# Altium schematic sheet SHEET3.SCHDOC
size A1
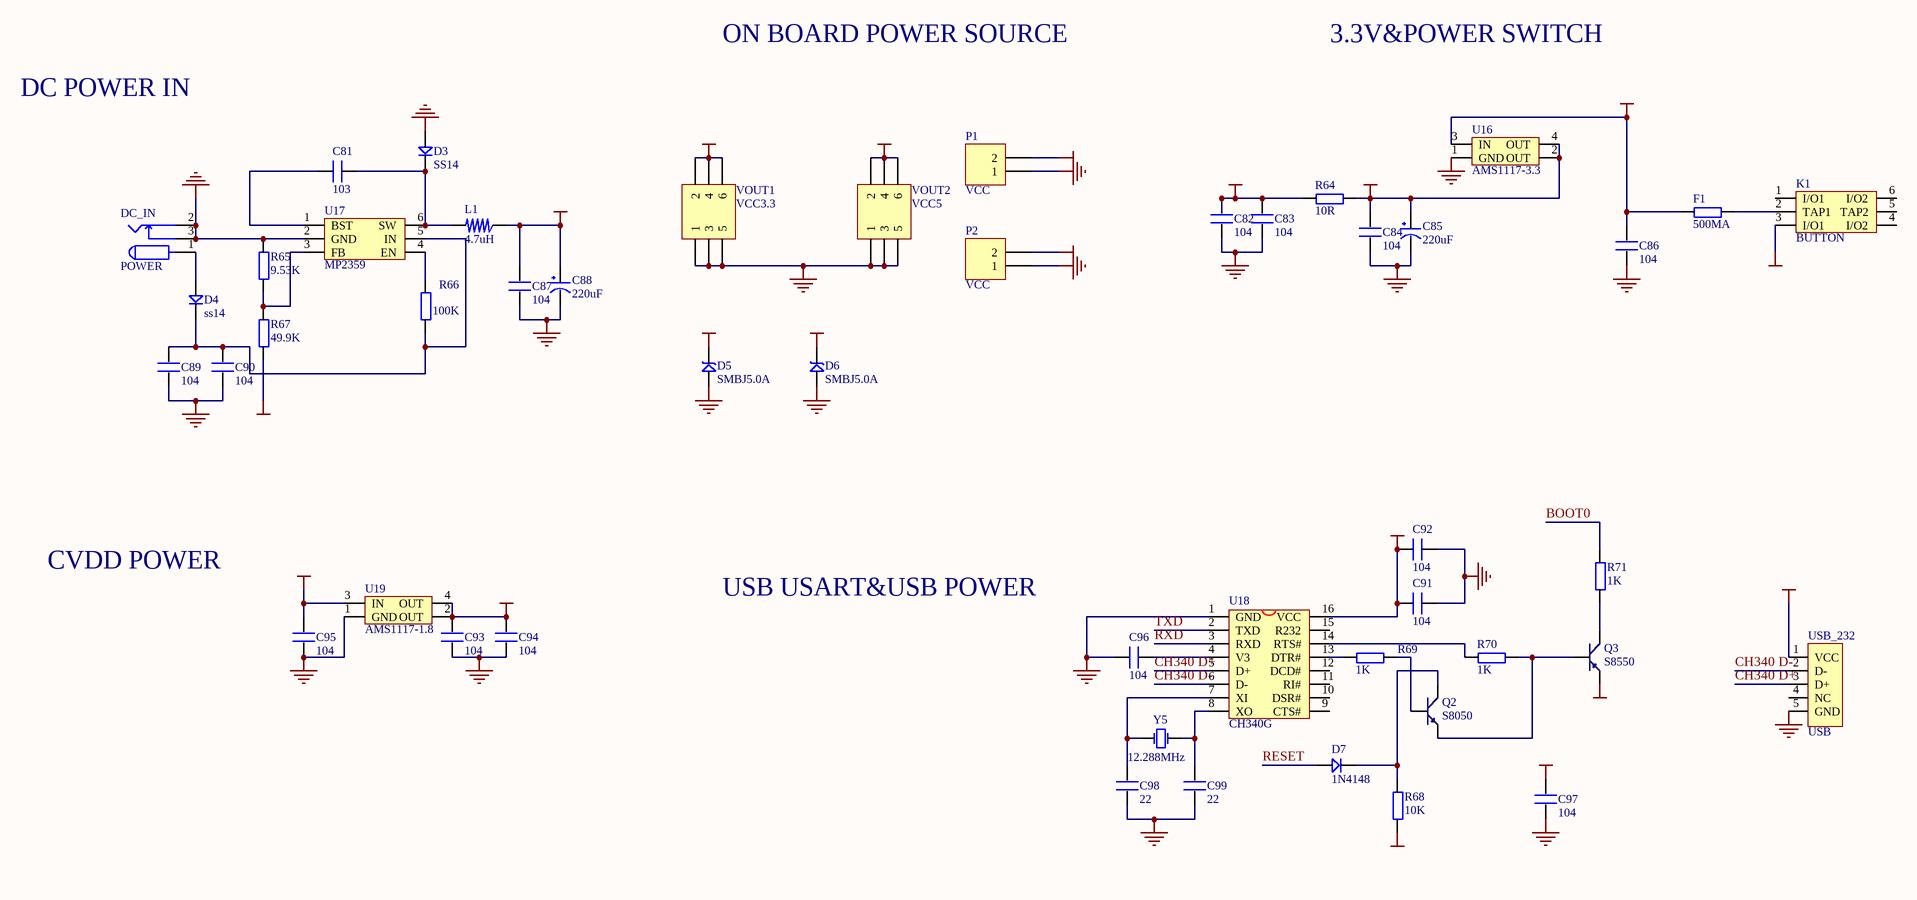
[diagram p0: SHEET3.SCHDOC]

## Parts
C81  103  [0603P]
C82  104  [0603P]
C83  104  [0603P]
C84  104  [0603P]
C85  220uF  [CC6.56.5]
C86  104  [0603P]
C87  104  [0603P]
C88  220uF  [CC6.56.5]
C89  104  [0603P]
C90  104  [0603P]
C91  104  [0603P]
C92  104  [0603P]
C93  104  [0603P]
C94  104  [0603P]
C95  104  [0603P]
C96  104  [0603P]
C97  104  [0603P]
C98  22  [0603P]
C99  22  [0603P]
D3  SS14  [DIODE_SOP]
D4  ss14  [DIODE_SOP]
D5  SMBJ5.0A  [SMBJ]
D6  SMBJ5.0A  [SMBJ]
D7  1N4148  [DIODE_SOP]
DC_IN  POWER  [DC10B]
F1  500MA  [0805]
K1  BUTTON  [BTN8.5*8.5]
L1  4.7uH  [L_SOP74]
P1  VCC  [HDR1X2]
P2  VCC  [HDR1X2]
Q2  S8050  [SOT-23R]
Q3  S8550  [SOT-23R]
R64  10R  [0603P]
R65  9.53K  [0603P]
R66  100K  [0603P]
R67  49.9K  [0603P]
R68  10K  [0603P]
R69  1K  [0603P]
R70  1K  [0603P]
R71  1K  [0603P]
U16  AMS1117-3.3  [AMS1117]
U17  MP2359  [SOT-23-6]
U18  CH340G  [SOP16M]
U19  AMS1117-1.8  [AMS1117]
USB_232  USB  [USB/SM0.8-6H5]
VOUT1  VCC3.3  [HDR2X3]
VOUT2  VCC5  [HDR2X3]
Y5  12.288MHz  [XTAL_US]

## Nets
AVDD: C82.2 C83.2 R64.1
CVDD: C93.2 C94.2 U19.2(OUT) U19.4(OUT)
GND: C82.1 C83.1 C84.1 C85.2(GND) C86.1 C87.1 C88.2(GND) C89.1 C90.1 C91.2 C92.2 C93.1 C94.1 C95.1 C96.1 C97.1 C98.1 C99.1 D3.1 D5.1 D6.1 DC_IN.2 DC_IN.3 P1.1 P2.1 R65.2 U16.1(GND) U17.2(GND) U18.1(GND) U19.1(GND) USB_232.5(GND) VOUT1.1 VOUT1.3 VOUT1.5 VOUT2.1 VOUT2.3 VOUT2.5
VCC3.3: C84.2 C85.1(VCC) D6.2 Q3.1(E) R64.2 R68.1 U16.2(OUT) U16.4(OUT) VOUT1.2 VOUT1.4 VOUT1.6
VCC5: C86.2 C91.1 C92.1 C95.2 C97.2 D5.2 F1.1 P1.2 P2.2 U16.3(IN) U18.16(VCC) U19.3(IN) VOUT2.2 VOUT2.4 VOUT2.6
VUSB: C87.2 C88.1(VCC) K1.3(I/O1) L1.1 R67.1 USB_232.1(VCC)
BOOT0: R71.2
CH340 D+: U18.5(D+) USB_232.3(D+)
CH340 D-: U18.6(D-) USB_232.2(D-)
RESET: D7.1
RXD: U18.3(RXD)
TXD: U18.2(TXD)
NetC81_1: C81.1 U17.1(BST)
NetC81_2: C81.2 D3.2 L1.2 U17.6(SW)
NetC89_2: C89.2 C90.2 D4.2 R66.1 U17.5(IN)
NetC96_2: C96.2 U18.4(V3)
NetC98_2: C98.2 U18.7(XI) Y5.1(OSC1)
NetC99_2: C99.2 U18.8(XO) Y5.2(OSC2)
NetD4_1: D4.1 DC_IN.1
NetD7_2: D7.2 Q2.3(C) R68.2
NetF1_2: F1.2 K1.2(TAP1)
NetQ2_1: Q2.1(E) Q3.2(B) R70.2
NetQ2_2: Q2.2(B) R69.2
NetQ3_3: Q3.3(C) R71.1
NetR65_1: R65.1 R67.2 U17.3(FB)
NetR66_2: R66.2 U17.4(EN)
NetR69_1: R69.1 U18.13(DTR#)
NetR70_1: R70.1 U18.14(RTS#)

Not connected (* = marked no-connect by the designer): K1 1(I/O1) 4(I/O2) 5(TAP2) 6(I/O2); U18 9(CTS#) 10(DSR#) 11(RI#) 12(DCD#) 15(R232); USB_232 4(NC)

## Notes on the sheet
- ON BOARD POWER SOURCE
- 3.3V&POWER SWITCH
- DC POWER IN
- CVDD POWER
- USB USART&USB POWER

## Library data of the parts
C81-C84 C86 C87 C89-C99 = C
C85 C88 = CAP
D3 D4 D7 = D
D5 D6 = SMBJ: TVS
DC_IN = POW
F1 R64-R71 = R
L1 = L_SOP
P1 P2 = Header 2: Header, 2-Pin; LatestRevisionDate: 17-Jul-2002; LatestRevisionNote: Re-released for DXP Platform.; Publisher: Altium Limited
Q2 = NPN: 8050/BCW846/BCW847
Q3 = PNP: 8550/BCW68
U16 U19 = AMS1117
U17 = MP2359: DC DC Step Down IC
U18 = CH340G: USB2UART
USB_232 = USB5
VOUT1 VOUT2 = Header 3X2: Header, 3-Pin, Dual row; LatestRevisionDate: 17-Jul-2002; LatestRevisionNote: Re-released for DXP Platform.; Publisher: Altium Limited
Y5 = XTAL_2: Crystal Oscillator; Published: 8-Jun-2000; LatestRevisionDate: 17-Jul-2002; LatestRevisionNote: Re-released for DXP Platform.; Publisher: Altium Limited